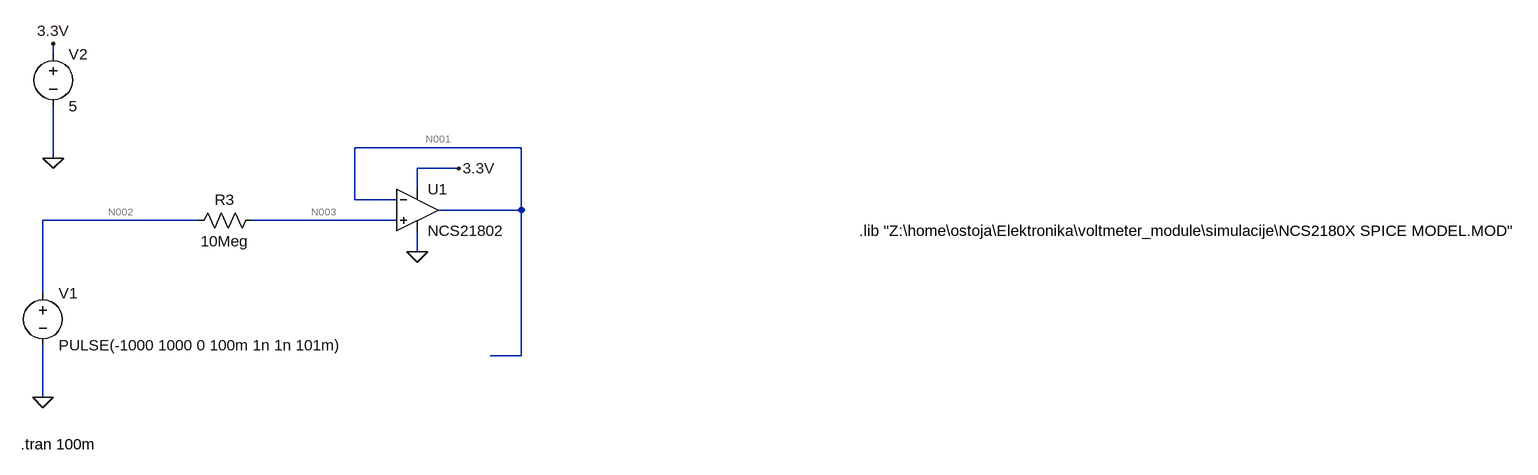
[diagram p0: schematic 000_input_protection.asc]
000_input_protection.asc, the LTspice schematic file:
Version 4
SHEET 1 1912 680
WIRE -448 -96 -448 -112
WIRE 272 48 16 48
WIRE -448 64 -448 -16
WIRE 176 80 112 80
WIRE 112 112 112 80
WIRE 16 128 16 48
WIRE 80 128 16 128
WIRE 272 144 272 48
WIRE 272 144 144 144
WIRE -224 160 -464 160
WIRE 80 160 -144 160
WIRE 112 208 112 176
WIRE -464 272 -464 160
WIRE 272 368 272 144
WIRE 272 368 224 368
WIRE -464 432 -464 352
FLAG -464 432 0
FLAG 112 208 0
FLAG 176 80 3.3V
FLAG -448 -112 3.3V
FLAG -448 64 0
SYMBOL res -128 144 R90
WINDOW 0 0 56 VBottom 2
WINDOW 3 32 56 VTop 2
SYMATTR InstName R3
SYMATTR Value 10Meg
SYMBOL voltage -464 256 R0
WINDOW 123 0 0 Left 0
WINDOW 39 0 0 Left 0
SYMATTR InstName V1
SYMATTR Value PULSE(-1000 1000 0 100m 1n 1n 101m)
SYMBOL voltage -448 -112 R0
WINDOW 123 0 0 Left 0
WINDOW 39 0 0 Left 0
SYMATTR InstName V2
SYMATTR Value 5
SYMBOL OpAmps\\opamp2 112 80 R0
SYMATTR InstName U1
SYMATTR Value NCS21802
TEXT -498 504 Left 2 !.tran 100m
TEXT 792 176 Left 2 !.lib "Z:\\home\\ostoja\\Elektronika\\voltmeter_module\\simulacije\\NCS2180X SPICE MODEL.MOD"

The netlist it stands for:
* 000_input_protection.asc
R3 N003 N002 10Meg
V1 N002 0 PULSE(-1000 1000 0 100m 1n 1n 101m)
V2 3.3V 0 5
XU1 N003 N001 3.3V 0 N001 NCS21802  ; pins In+ In- V+ V- OUT
.tran 100m
.lib "Z:\home\ostoja\Elektronika\voltmeter_module\simulacije\NCS2180X SPICE MODEL.MOD"
.backanno
.end

* Results of the author's LTspice run, read from the files saved beside the schematic
* Operating Point, zero values left out:
*   V(n003) = -481.2 mV
*   V(n002) = -1 kV
*   V(3.3v) = 5 V
*   V(n001) = 1.485 mV
*   I(R3) = 99.95 µA
*   I(V2) = -147.6 µA
*   I(V1) = 99.95 µA
*   Ix(u1:1) = -99.95 µA
*   Ix(u1:2) = 9.37 pA
*   Ix(u1:3) = 147.6 µA
*   Ix(u1:4) = -147.6 µA
*   Ix(u1:5) = -9.374 pA
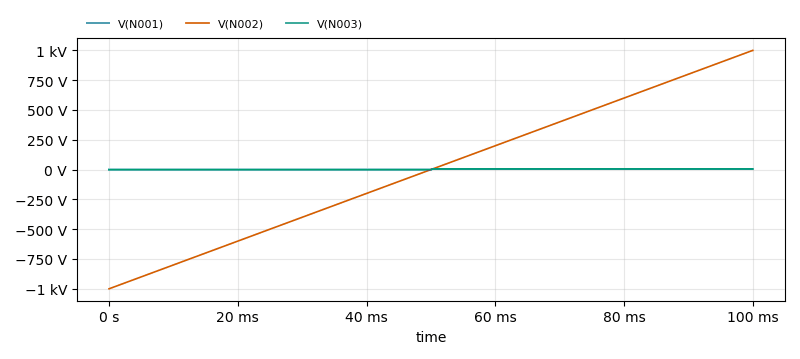
[diagram p1: Transient Analysis of 000_input_protection.asc, plotted from the saved traces]
* Transient Analysis, 1 run:
*   V(N001): min 1.481 mV, max 4.999 V, average 2.483 V, rms 3.514 V, last 4.891 V
*   V(N002): min -1 kV, max 1 kV, average 0 V, rms 592.7 V, last 1 kV
*   V(N003): min -481.2 mV, max 5.481 V, average 2.49 V, rms 3.86 V, last 5.481 V